# Altium schematic sheet Limiter.SchDoc
size A4
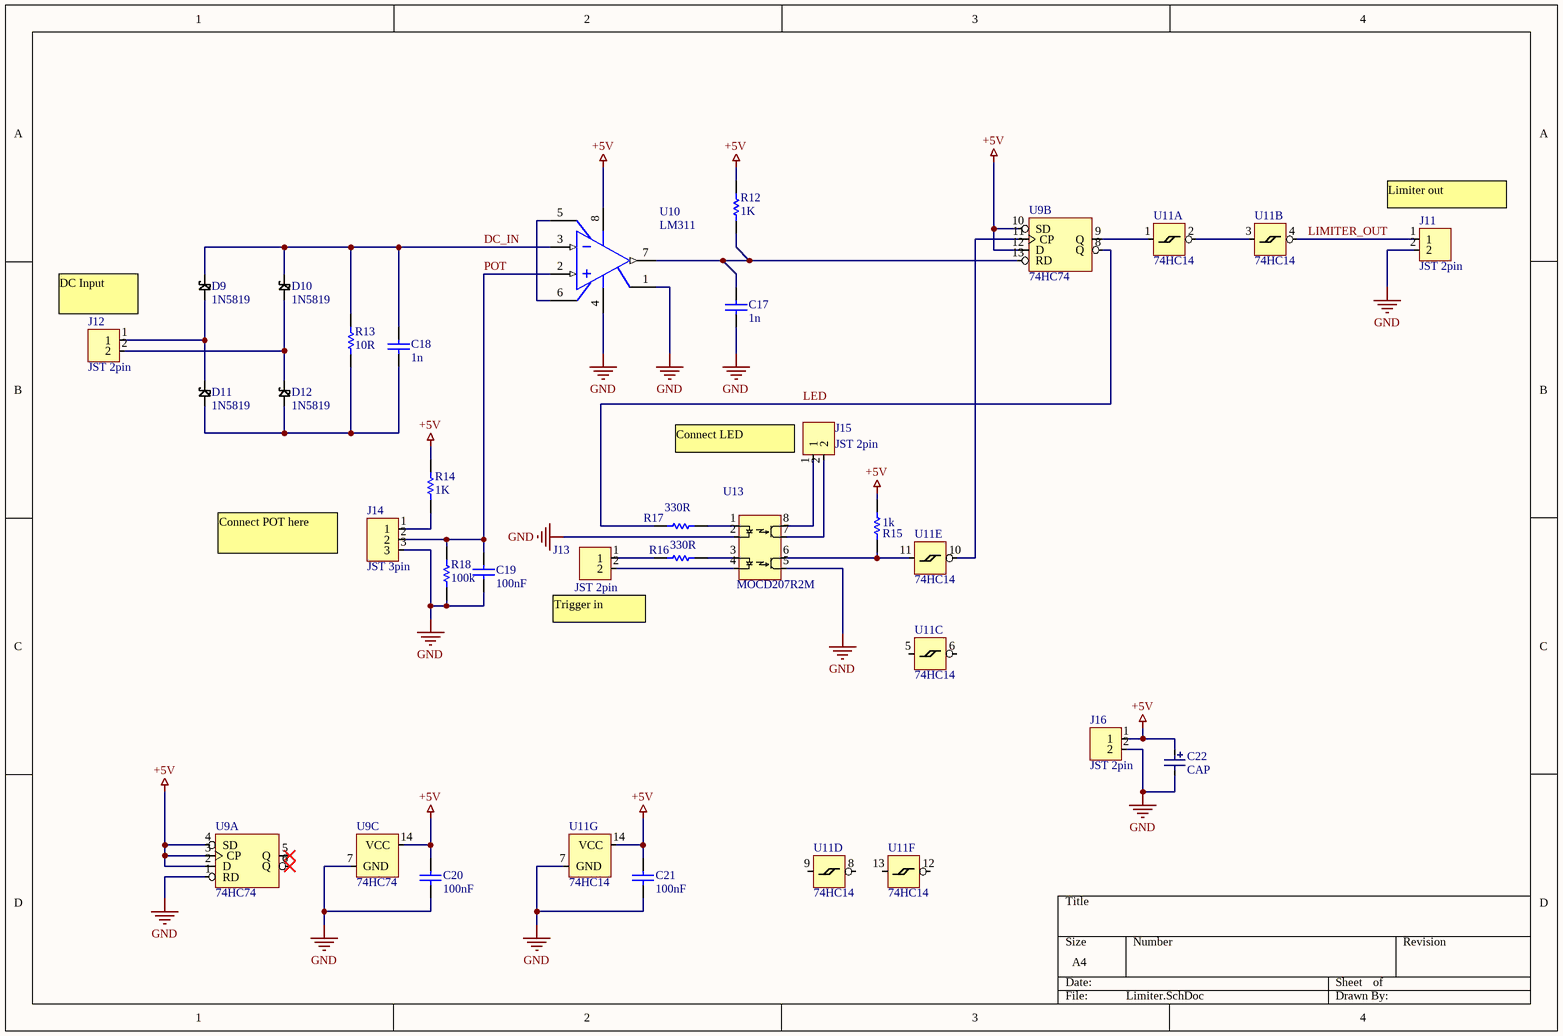
[diagram p0: Limiter.SchDoc]

## Parts
C17  1n  [CAPC0805(2012)100_L]
C18  1n  [CAPC0805(2012)100_L]
C19  100nF  [CAPC0805(2012)100_L]
C20  100nF  [CAPC0805(2012)100_L]
C21  100nF  [CAPC0805(2012)100_L]
C22  CAP  [CAP 2.5mm]
D9  1N5819  [1N5819]
D10  1N5819  [1N5819]
D11  1N5819  [1N5819]
D12  1N5819  [1N5819]
J11  JST 2pin  [JST 2pin]
J12  JST 2pin  [JST 2pin]
J13  JST 2pin  [JST 2pin]
J14  JST 3pin  [JST 3pin]
J15  JST 2pin  [JST 2pin]
J16  JST 2pin  [JST 2pin]
R12  1K  [RESC0805(2012)_L]
R13  10R  [RESC0805(2012)_L]
R14  1K  [RESC0805(2012)_L]
R15  value 1k  [RESC0805(2012)_N]  (hidden comment: 1K 5% 0805(2012))
R16  value 330R  [RESC0805(2012)_L]  (hidden comment: 330R 5% 0805(2012))
R17  value 330R  [RESC0805(2012)_L]  (hidden comment: 330R 5% 0805(2012))
R18  100k  [RESC0805(2012)_L]
U9  74HC74  [SOP14]  (parts A,B,C of 3)
U10  LM311  [SOIC8-WIDE]
U11  74HC14  [SOP14]  (parts A,B,C,D,E,F,G of 7)
U13  MOCD207R2M  [SOP8]

## Nets
+5V: C20.2 C21.2 C22.2 J16.1 R12.1 R14.1 R15.2 U9.2(D) U9.3(CP) U9.4(SD) U9.10(SD) U9.12(D) U9.14(VCC) U10.8(V+) U11.14(VCC)
GND: C17.1 C19.1 C20.1 C21.1 C22.1 J11.2 J14.3 J16.2 R18.2 U9.1(RD) U9.7(GND) U10.1(GND) U10.4(V-) U11.7(GND) U13.2 U13.5
DC_IN: C18.2 D9.K D10.K R13.1 U10.3(IN-)
LED: R17.2 U9.8(Q)
LIMITER_OUT: J11.1 U11.4
POT: C19.2 J14.2 R18.1 U10.2(IN+)
NetC17_2: C17.2 R12.2 U9.13(RD) U10.7(OUT)
NetC18_1: C18.1 D11.A D12.A R13.2
NetD9_A: D9.A D11.K J12.1
NetD10_A: D10.A D12.K J12.2
NetJ13_1: J13.1 R16.2
NetJ13_2: J13.2 U13.4
NetJ14_1: J14.1 R14.2
NetJ15_1: J15.1 U13.8
NetJ15_2: J15.2 U13.7
NetR15_1: R15.1 U11.11 U13.6
NetR16_1: R16.1 U13.3
NetR17_1: R17.1 U13.1
NetU9_9: U9.9(Q) U11.1
NetU9_11: U9.11(CP) U11.10
NetU10_5: U10.5(BAL) U10.6(BAL/STB)
NetU11_2: U11.2 U11.3

Not connected (* = marked no-connect by the designer): U9 5(Q)* 6(Q)*; U11 5 6 8 9 12 13

## Notes on the sheet
- (near J11) Limiter out
- (near J12) DC Input
- (near J15) Connect LED
- Connect POT here
- Trigger in

## Library data of the parts
C17-C21 = CMP-1036-04418-1: CAP 100nF 50V ±5% 0805 (2012 Metric) Thickness 1mm SMD; Case-EIA: 0805; Case-Metric: 2012; Tolerance: ±5%; Max Thickness: 1 mm; Technology: SMT; Value: 100nF; Rated Voltage: 50 V
R12-R14 R16-R18 = CMP-1013-00062-1: 330R 0.125W 5% 0805 (2012 Metric)  SMD; Case-EIA: 0805; Case-Metric: 2012; Tolerance: 5 %; Power: 0.125 W; Technology: SMT
  R12 R14: Value: 1K
  R13: Value: 10R
  R18: Value: 100k
R15 = CMP-1013-00074-1: 1K 0.125W 5% 0805 (2012 Metric)  SMD; Case-EIA: 0805; Case-Metric: 2012; Technology: SMT; Power: 0.125 W; Tolerance: 5 %